# Altium schematic sheet APD9328_TOP.SchDoc: PERIPH TOP
size A4; Author: NC; Revision: 1.0; SheetNumber: 9; SheetTotal: 14
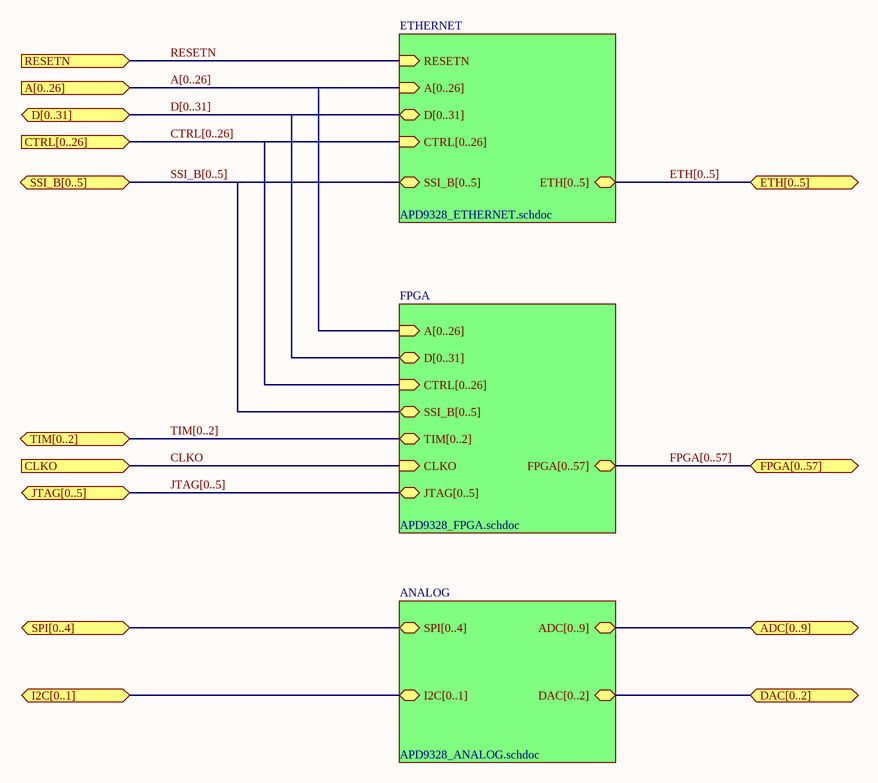
[diagram p0: APD9328_TOP.SchDoc]

## Sub-sheets
ANALOG = APD9328_ANALOG.schdoc: ADC[0..9] (bidir), DAC[0..2] (bidir), SPI[0..4] (bidir), I2C[0..1] (bidir)
ETHERNET = APD9328_ETHERNET.schdoc: A[0..26] (in), D[0..31] (bidir), CTRL[0..26] (in), ETH[0..5] (bidir), RESETN (in), SSI_B[0..5] (bidir)
FPGA = APD9328_FPGA.schdoc: A[0..26] (in), D[0..31] (bidir), CTRL[0..26] (in), FPGA[0..57] (bidir), CLKO (in), SSI_B[0..5] (bidir), TIM[0..2] (bidir), JTAG[0..5] (bidir)

## Ports
A[0..26] (in), ADC[0..9] (bidir), CLKO (in), CTRL[0..26] (in), D[0..31] (bidir), DAC[0..2] (bidir), ETH[0..5] (bidir), FPGA[0..57] (bidir), I2C[0..1] (bidir), JTAG[0..5] (bidir), RESETN (in), SPI[0..4] (bidir), SSI_B[0..5] (bidir), TIM[0..2] (bidir)

## Nets
CLKO: port CLKO, sheet FPGA/CLKO
RESETN: port RESETN, sheet ETHERNET/RESETN

## Buses and harness runs
bus A[0..26] = port A[0..26] = sheet ETHERNET/A[0..26] = sheet FPGA/A[0..26]
bus CTRL[0..26] = port CTRL[0..26] = sheet ETHERNET/CTRL[0..26] = sheet FPGA/CTRL[0..26]
bus D[0..31] = port D[0..31] = sheet ETHERNET/D[0..31] = sheet FPGA/D[0..31]
bus ETH[0..5] = port ETH[0..5] = sheet ETHERNET/ETH[0..5]
bus FPGA[0..57] = port FPGA[0..57] = sheet FPGA/FPGA[0..57]
bus JTAG[0..5] = port JTAG[0..5] = sheet FPGA/JTAG[0..5]
bus port ADC[0..9] = sheet ANALOG/ADC[0..9]
bus port DAC[0..2] = sheet ANALOG/DAC[0..2]
bus port I2C[0..1] = sheet ANALOG/I2C[0..1]
bus port SPI[0..4] = sheet ANALOG/SPI[0..4]
bus SSI_B[0..5] = port SSI_B[0..5] = sheet ETHERNET/SSI_B[0..5] = sheet FPGA/SSI_B[0..5]
bus TIM[0..2] = port TIM[0..2] = sheet FPGA/TIM[0..2]

## Notes on the sheet
- Title
- Size:
- Date:
- A4
- Author:
- Revision:
- Sheet
- of
- Armadeus Embedded Solutions
- File: